# EAGLE design light (EAGLE 9.6.2)
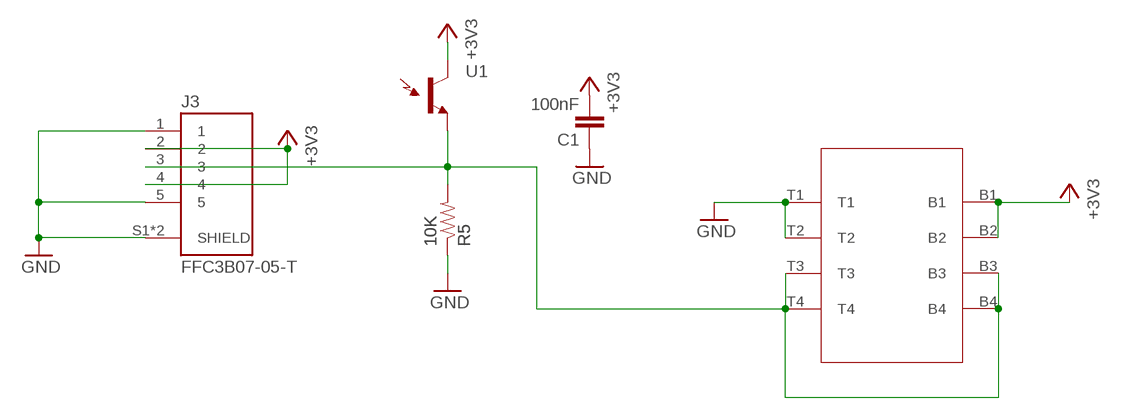
[diagram p0: schematic, sheet 1]

## Parts
C1  100nF  CAP0805  [0805]
J3  FFC3B07-05-T  [GCT_FFC3B07-05-T]
R5  10K  RESISTOR0805-RES  [0805]
U1  TEMT6000  [TEMT6000-SEN]
U$1  LS_VERT  [LS_VERT]

## Nets
+3V3: C1.2 J3.2 J3.4 U1.COLLECTOR(C1) U$1.B1 U$1.B2
GND: C1.1 J3.1 J3.5 J3.S1(SHIELD) J3.S2(SHIELD) R5.1 U$1.T1 U$1.T2
S: J3.3 R5.2 U1.EMITTER(E1) U$1.B3 U$1.B4 U$1.T3 U$1.T4

## Library data of the parts
C1 = clock:CAP: Capacitor Standard 0603 ceramic capacitor, and 0.1" leaded capacitor.
J3 = FFC3B07-05-T:FFC3B07-05-T: FPC 1.0mm Pitch, Side entry, Top contact, SMT, Height 2.5mm, Slide type Check availability <https://pricing.snapeda.com/parts/FFC3B07-05-T/Global%20Connector%20Technology/view-part?ref=eda>; AVAILABILITY: In Stock; CHECK_PRICES: https://www.snapeda.com/parts/FFC3B07-05-T/Global+Connector+Technology/view-part/?ref=eda; DESCRIPTION: 5 Position FFC, FPC Connector Contacts, Bottom 0.039 (1.00mm) Surface Mount, Right Angle; MF: Global Connector Technology; MP: FFC3B07-05-T; PACKAGE: None; PRICE: None; SNAPEDA_LINK: https://www.snapeda.com/parts/FFC3B07-05-T/Global+Connector+Technology/view-part/?ref=snap
R5 = joyAnalog:RESISTOR: Resistor Basic schematic elements and footprints for 0603, 1206, and PTH resistors.
U1 = SparkFun:TEMT6000: Ambient Light Sensor Simple light detection sensor. Output varies with light intensity input. Spark Fun Electronics SKU : COM-08348
U$1 = apricot:LS_VERT

## Board
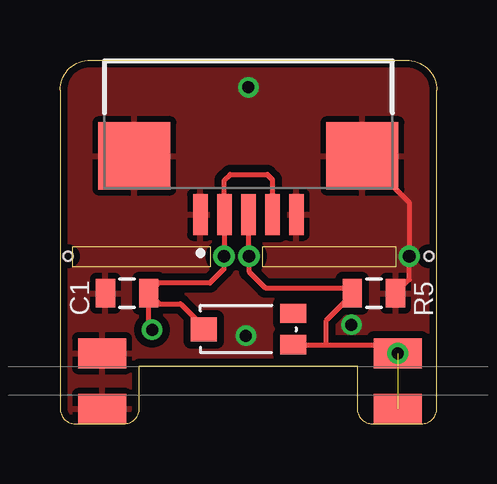
[diagram p1: board, top side]
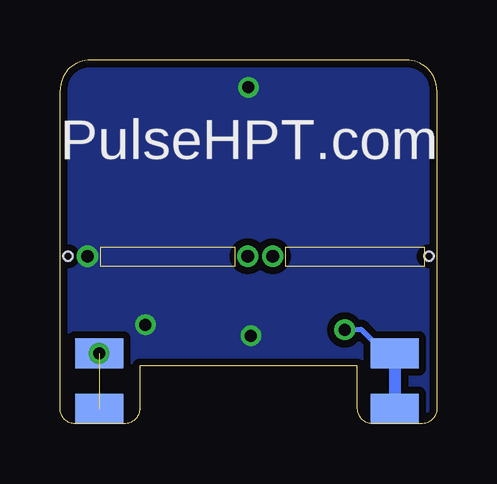
[diagram p2: board, bottom side, seen from below]

Size 15.7 x 15.17 mm. Coordinates in mm from the lower left corner, seen from the top.
Outline: 1.27,15.17 14.43,15.17 arc-90 15.7,13.9 15.7,0.64 arc-90 15.06,0 13.02,0 arc-90 12.38,0.64 12.38,2.4 3.31,2.4 3.31,0.64 arc-90 2.67,0 0.64,0 arc-90 0,0.64 0,13.9 arc-90 1.27,15.17
Copper layers (1*16): Top 0.035mm / dielectric 1.5mm / Bottom 0.035mm
Design rules "deku_2layer_6mil": minimum track width 6mil, minimum drill 15mil, track to track 6mil, track to pad 6mil, pad to pad 6mil, via to via 6mil, smd to smd 6mil, copper to edge 10mil, drill to drill 6mil, minimum pad ring 7mil, minimum via ring 7mil, stop-mask expansion 4mil, vias tented up to drill 25mil, thermal gap 10mil
Holes 0.38 mm at 15.37,6.99 0.33,6.99
Milling: area 0.5,6.6 to 6.3,7.4; area 8.4,6.6 to 14,7.4

### Footprints (pad centres in the part's own frame; a part is rotated, then mirrored left to right if it is on the bottom)
0805 = smd 0.8 x 1.2: 1 -0.9,0; 2 0.9,0
GCT_FFC3B07-05-T = smd 0.6 x 1.7: 1 2,2.45; 2 1,2.45; 3 0,2.45; 4 -1,2.45; 5 -2,2.45 | smd 3 x 2.8: S1 4.75,0; S2 -4.75,0
TEMT6000-SEN = smd 1.1 x 0.8: BASE -1.87,-0.65; EMITTER -1.87,0.65 | smd 1.1 x 1: COLLECTOR 1.86,0.01
LS_VERT = smd 1.25 x 2 bottom: B1 -0.557,6.096; B2 1.759,6.096; B3 -0.557,-6.223; B4 1.759,-6.223 | smd 1.25 x 2: T1 -0.557,6.096; T2 1.759,6.096; T3 -0.557,-6.223; T4 1.759,-6.223

### Placement (x,y rotation side)
C1  2.79,5.44 0 top
J3  7.85,11.17 180 top
R5  13.08,5.44 180 top
U1  7.85,3.94 180 top
U$1  7.85,1.17 90 top

### Tracks (layer width: path | path; a pad name or v marks a point on that pad's centre or on a via)
+3V3  (via drill 0.5, 0.53)
  Top 0.203: J3.4 8.85,10.18 8.64,10.39 7.09,10.39 6.85,10.16 J3.2 6.85,7 v6.83,6.99 6.83,6.45 6.25,5.87 4.12,5.87 C1.2 | v3.83,3.92 3.69,4.06 C1.2 | C1.2 4.13,5 5.03,5 5.99,4.04 U1.COLLECTOR
  Bottom 0.203: v3.83,3.92 3.82,3.93 3.15,3.93 2.15,2.93 U$1.B2
  Bottom 0.508: U$1.B2 U$1.B1
GND  (via drill 0.5, 0.53)
  Top 0.203: J3.S2 14.55,9.22 v14.55,6.99 14.55,6.01 R5.1
  other vias: 7.75,3.66 12.14,4.12 7.85,14.03
  pour Top (isolate 0.305): -37.85,30 -37.85,-38 54.64,-38 54.64,30
  pour Bottom (isolate 0.305): -36,26 52,26 52,-34 -36,-34
S  (via drill 0.5, 0.53)  (2 unrouted)
  Top 0.203: U1.EMITTER 11.07,3.29 | 11.07,3.29 14.07,3.29 U$1.T4 | R5.2 12.19,5.43 | J3.3 7.85,7.01 v7.87,6.99 7.87,6.35 8.56,5.66 11.96,5.66 R5.2 | R5.2 12.18,5.39 11.07,4.29 11.07,3.29
  other vias: 14.07,2.93

### Text on the board
bNames: PulseHPT.com